# Altium project BRR_CB_P03_REV_A1_1-STM32MP157.PrjPcb (part 3 of 3)

## Sheet HB_Logic_Power_Controller.SchDoc
size A4; SheetNumber: 14; SheetTotal: 14
Used 4 times, as channels U_HB_Logic_Power_Controller, U_HB_Logic_Power_Controller, U_HB_Logic_Power_Controller, U_HB_Logic_Power_Controller. Parts and nets are listed once, with the designators drawn on the sheet.
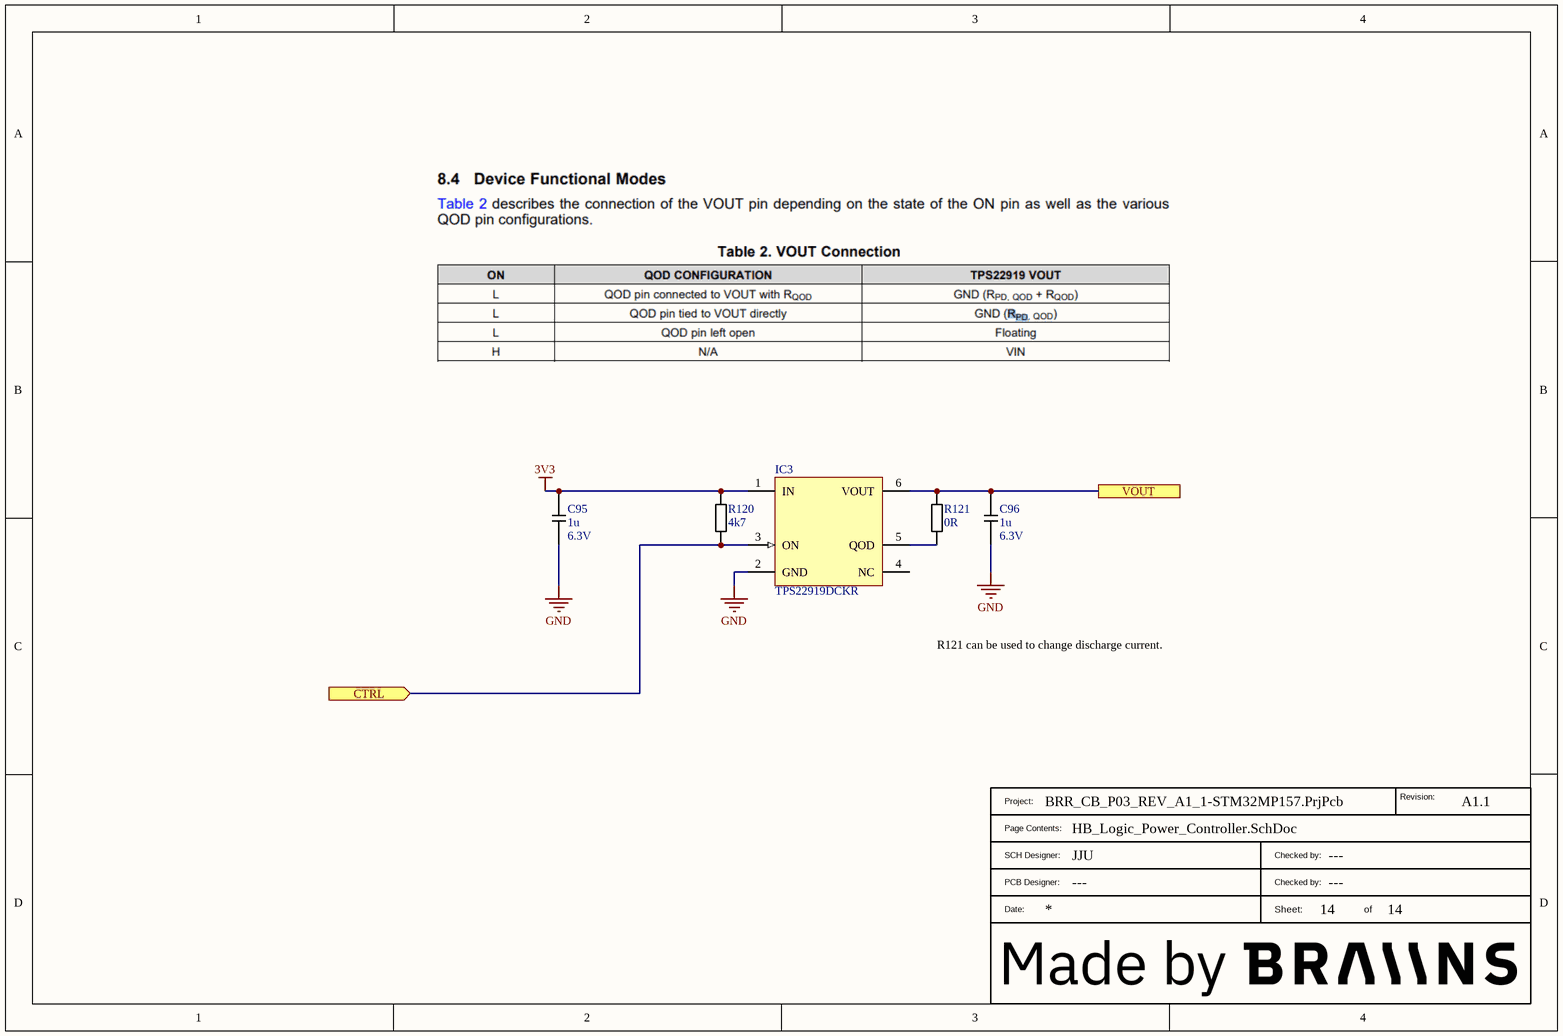
[diagram p13: HB_Logic_Power_Controller.SchDoc]

### Parts
?  BraiinsTitleBlockWithLogo  (value not drawn)  (graphical)
C95  Voltage_Rating: 6.3V  [CAP0402]  (hidden comment: 1u)
C96  Voltage_Rating: 6.3V  [CAP0402]  (hidden comment: 1u)
IC3  TPS22919DCKR  [SC-70]
R120  4k7  [RES0402]
R121  0R  [RES0603]

### Ports
CTRL (in), VOUT

### Nets
3V3: C95.1 IC3.1(IN) R120.2
GND: C95.2 C96.2 IC3.2(GND)
CTRL: IC3.3(ON) R120.1 ; port CTRL
VOUT: C96.1 IC3.6(VOUT) R121.1 ; port VOUT
NetIC3_5: IC3.5(QOD) R121.2

Not connected (* = marked no-connect by the designer): IC3 4(NC)

### Channels
U_HB_Logic_Power_Controller: designators ?=?A#2 C95=C95A C96=C96A IC3=IC3A R120=R120A R121=R121A; ports CTRL=HB_PWR_CTL0 VOUT=3V3_PROTECTED
U_HB_Logic_Power_Controller: designators ?=?B#2 C95=C95B C96=C96B IC3=IC3B R120=R120B R121=R121B; ports CTRL=HB_PWR_CTL1 VOUT=3V3_PROTECTED
U_HB_Logic_Power_Controller: designators ?=?C#2 C95=C95C C96=C96C IC3=IC3C R120=R120C R121=R121C; ports CTRL=HB_PWR_CTL2 VOUT=3V3_PROTECTED
U_HB_Logic_Power_Controller: designators ?=?D#2 C95=C95D C96=C96D IC3=IC3D R120=R120D R121=R121D; ports CTRL=HB_PWR_CTL3 VOUT=3V3_PROTECTED

### Notes on the sheet
- R121 can be used to change discharge current.
- (in symbol BraiinsTitleBlockWithLogo) Revision:; Project:; Page Contents:; SCH Designer:; Checked by:; PCB Designer:; Date:; Sheet:; of

### Library data of the parts
C95 C96 = 30155: as C60-C78 on sheet MPU PWR; Value: 1u; Sub_Type: CER; Manufacturer Part Description: CAP CER 1u 10% 6.3V X7R 0402; Package_Case: 0402; RoHS: Yes; Dielectric: X7R; Tolerance: 10%; Created By: janjuranek; Created_Date: 2023-05-01 19:24:23; Updated_Date: 2023-05-01 19:25:09; ComponentLink1Description: Datasheet; ComponentLink2Description: Supplier Part Details
IC3 = 30187: Self-Protected Load Switch, 5.5 V, 1.5 A, 90-mΩ; Part_Type: IC; Part_Status: New; ID: 30187; Updated By: janjuranek; Value: TPS22919DCKR; Manufacturer Part Number: TPS22919DCKR; Manufacturer Part Description: Self-Protected Load Switch, 5.5 V, 1.5 A, 90-mΩ; Package_Case: SC-70; RoHS: Yes; Created By: janjuranek; Created_Date: 2023-05-26 10:45:28; Updated_Date: 2023-05-26 10:46:59; ComponentLink1Description: Datasheet; ComponentLink2Description: Supplier Part Details
R120 = 30073: as R85-R87 on sheet HBInterface; Value: 4k7; Part_Type: Resistor; Manufacturer Part Description: RES 4k7 Ohm 1% 0402; Package_Case: 0402; RoHS: Yes; Temperature Range: -40 to +150C; Tolerance: 1%; Created By: Jan; Created_Date: 2023-03-02 13:15:12; Updated_Date: 2023-03-02 13:15:46; ComponentLink1Description: Datasheet; ComponentLink2Description: Supplier Part Details
R121 = 30097: RES 0R Ohm 1% 0603; Part_Status: New; ID: 30097; Updated By: janjuranek; Sorted_Value: 0; Value: 0R; Part_Type: Resistor; Manufacturer Part Description: RES 0R Ohm 1% 0603; Package_Case: 0603; RoHS: Yes; Tolerance: 1%; Created By: janjuranek; Created_Date: 2023-03-07 17:09:44; Updated_Date: 2023-03-07 22:04:59; ComponentLink1Description: Datasheet; ComponentLink2Description: Supplier Part Details

## Nets that join several sheets
1V35: MPU (45 pins), PowerSupply (5 pins), RAM (30 pins), MPU PWR (21 pins)
3V3: MPU (21 pins), Ethernet (13 pins), Fan (R29.1 R30.1 R33.1 R34.1), PowerSupply (5 pins), SDCard (11 pins), EMMC (17 pins), RAM (C93.1 C94.1 IC2.6), Debug (CON11.8 R23.1 R24.1), UserInterface (R90.2), PowerSupplyInterface (R94.1 R95.1), MPU PWR (C81.1 C82.1 C83.1 C84.1), U_HB_Logic_Power_Controller (C95A.1 IC3A.1 R120A.2), U_HB_Logic_Power_Controller (C95B.1 IC3B.1 R120B.2), U_HB_Logic_Power_Controller (C95C.1 IC3C.1 R120C.2), U_HB_Logic_Power_Controller (C95D.1 IC3D.1 R120D.2)
12V: Fan (CON1.3 CON2.3 CON3.3 CON4.3), PowerSupply (CON6.1 CON6.3 CON6.5 D5.2)
DDR_VREF: MPU (U1.W16), RAM (48 pins)
GND: MPU (106 pins), Ethernet (20 pins), Fan (8 pins), PowerSupply (24 pins), SDCard (5 pins), EMMC (17 pins), RAM (62 pins), U_HBInterface_0 (10 pins), U_HBInterface_1 (9 pins), U_HBInterface_2 (9 pins), U_HBInterface_3 (8 pins), Debug (CON10.1 CON11.1 S1.1), UserInterface (C50.2 D9.2 D9.4 S2.1), PowerSupplyInterface (CON8.3), MPU PWR (25 pins), U_HB_Logic_Power_Controller (C95A.2 C96A.2 IC3A.2), U_HB_Logic_Power_Controller (C95B.2 C96B.2 IC3B.2), U_HB_Logic_Power_Controller (C95C.2 C96C.2 IC3C.2), U_HB_Logic_Power_Controller (C95D.2 C96D.2 IC3D.2)
3V3_PROTECTED: U_HBInterface_0 (CON7A.16 R85A.1 R86A.1), U_HB_Logic_Power_Controller (C96A.1 IC3A.6 R121A.1)
3V3_PROTECTED: U_HBInterface_1 (CON7B.8 CON7B.16 R85B.1 R86B.1), U_HB_Logic_Power_Controller (C96B.1 IC3B.6 R121B.1)
3V3_PROTECTED: U_HBInterface_2 (CON7C.7 CON7C.16 R85C.1 R86C.1), U_HB_Logic_Power_Controller (C96C.1 IC3C.6 R121C.1)
3V3_PROTECTED: U_HBInterface_3 (5 pins), U_HB_Logic_Power_Controller (C96D.1 IC3D.6 R121D.1)
BOOT0: MPU (U1.K1), SDCard (R117.2)
BOOT1: MPU (U1.K4), SDCard (R118.2)
BOOT2: MPU (U1.L2), SDCard (R106.2)
CARD_DETECT: MPU (U1.K3), SDCard (R119.2)
DDR3_A0: MPU (U1.H18), RAM (IC6.N3 R57.1)
DDR3_A1: MPU (U1.M17), RAM (IC6.P7 R58.1)
DDR3_A2: MPU (U1.G18), RAM (IC6.P3 R59.1)
DDR3_A3: MPU (U1.F19), RAM (IC6.N2 R60.1)
DDR3_A4: MPU (U1.P17), RAM (IC6.P8 R61.1)
DDR3_A5: MPU (U1.H17), RAM (IC6.P2 R62.1)
DDR3_A6: MPU (U1.N16), RAM (IC6.R8 R65.1)
DDR3_A7: MPU (U1.E17), RAM (IC6.R2 R66.1)
DDR3_A8: MPU (U1.R17), RAM (IC6.T8 R67.1)
DDR3_A9: MPU (U1.G17), RAM (IC6.R3 R69.1)
DDR3_A10: MPU (U1.M19), RAM (IC6.L7 R70.1)
DDR3_A11: MPU (U1.M18), RAM (IC6.R7 R71.1)
DDR3_A12: MPU (U1.L17), RAM (IC6.N7 R73.1)
DDR3_A13: MPU (U1.F17), RAM (IC6.T3 R74.1)
DDR3_BA0: MPU (U1.G19), RAM (IC6.M2 R76.1)
DDR3_BA1: MPU (U1.N17), RAM (IC6.N8 R77.1)
DDR3_BA2: MPU (U1.J16), RAM (IC6.M3 R78.1)
DDR3_CASN: MPU (U1.K17), RAM (IC6.K3 R80.1)
DDR3_CKE: MPU (U1.P19), RAM (IC6.K9 R68.1 R82.1)
DDR3_CLK_N: MPU (U1.K19), RAM (IC6.K7 R63.2)
DDR3_CLK_P: MPU (U1.L19), RAM (IC6.J7 R63.1)
DDR3_CSN: MPU (U1.J18), RAM (IC6.L2 R81.1)
DDR3_DQ0: MPU (U1.A17), RAM (IC6.E3)
DDR3_DQ1: MPU (U1.A18), RAM (IC6.F7)
DDR3_DQ2: MPU (U1.D18), RAM (IC6.F2)
DDR3_DQ3: MPU (U1.B17), RAM (IC6.F8)
DDR3_DQ4: MPU (U1.E18), RAM (IC6.H3)
DDR3_DQ5: MPU (U1.D17), RAM (IC6.H8)
DDR3_DQ6: MPU (U1.D19), RAM (IC6.G2)
DDR3_DQ7: MPU (U1.B18), RAM (IC6.H7)
DDR3_DQ8: MPU (U1.P18), RAM (IC6.D7)
DDR3_DQ9: MPU (U1.T17), RAM (IC6.C3)
DDR3_DQ10: MPU (U1.R18), RAM (IC6.C8)
DDR3_DQ11: MPU (U1.V19), RAM (IC6.C2)
DDR3_DQ12: MPU (U1.W18), RAM (IC6.A7)
DDR3_DQ13: MPU (U1.T18), RAM (IC6.A2)
DDR3_DQ14: MPU (U1.V18), RAM (IC6.B8)
DDR3_DQ15: MPU (U1.W17), RAM (IC6.A3)
DDR3_DQM0: MPU (U1.C18), RAM (IC6.E7)
DDR3_DQM1: MPU (U1.U18), RAM (IC6.D3)
DDR3_DQS0_N: MPU (U1.C19), RAM (IC6.F3)
DDR3_DQS0_P: MPU (U1.B19), RAM (IC6.G3)
DDR3_DQS1_N: MPU (U1.T19), RAM (IC6.B7)
DDR3_DQS1_P: MPU (U1.U19), RAM (IC6.C7)
DDR3_ODT: MPU (U1.H19), RAM (IC6.K1 R84.1)
DDR3_RASN: MPU (U1.L18), RAM (IC6.J3 R79.1)
DDR3_RESETN: MPU (U1.G16), RAM (IC6.T2 R72.1)
DDR3_WEN: MPU (U1.J17), RAM (IC6.L3 R83.1)
EMMC_RESET: MPU (U1.A9), EMMC (IC5.K5 R53.2)
ETH_CLK: MPU (R75.2 R116.2), Ethernet (R15.1)
ETH_CRS_DV: MPU (U1.T6), Ethernet (R13.1)
ETH_MDC: MPU (U1.V2), Ethernet (R99.1)
ETH_MDIO: MPU (U1.W2), Ethernet (IC1.16 R8.2)
ETH_PHY_RESET: MPU (U1.T7), Ethernet (IC1.19 R103.1)
ETH_RXD0: MPU (U1.W4), Ethernet (R11.1)
ETH_RXD1: MPU (U1.V4), Ethernet (R10.1)
ETH_TX_EN: MPU (U1.V1), Ethernet (R100.1)
ETH_TXD0: MPU (U1.U2), Ethernet (R101.1)
ETH_TXD1: MPU (U1.T9), Ethernet (R102.1)
HB0_PLUG: MPU (U1.D6), U_HBInterface_0 (CON7A.5 R87A.1)
HB0_RESET: MPU (U1.C5), U_HBInterface_0 (CON7A.15)
HB1_PLUG: MPU (U1.V7), U_HBInterface_1 (CON7B.5 R87B.1)
HB1_RESET: MPU (U1.W9), U_HBInterface_1 (CON7B.15)
HB2_PLUG: MPU (U1.V10), U_HBInterface_2 (CON7C.5 R87C.1)
HB2_RESET: MPU (U1.U10), U_HBInterface_2 (CON7C.15)
HB3_PLUG: MPU (U1.C2), U_HBInterface_3 (CON7D.5 R87D.1)
HB3_RESET: MPU (U1.C1), U_HBInterface_3 (CON7D.15)
HB_PWR_CTL0: MPU (U1.G1), U_HB_Logic_Power_Controller (IC3A.3 R120A.1)
HB_PWR_CTL1: MPU (U1.F1), U_HB_Logic_Power_Controller (IC3B.3 R120B.1)
HB_PWR_CTL2: MPU (U1.E1), U_HB_Logic_Power_Controller (IC3C.3 R120C.1)
HB_PWR_CTL3: MPU (U1.U1), U_HB_Logic_Power_Controller (IC3D.3 R120D.1)
HB_RXD: MPU (U1.T8), U_HBInterface_1 (CON7B.12 R85B.2)
HB_RXD: MPU (U1.G3), U_HBInterface_0 (CON7A.12 R85A.2)
HB_RXD: MPU (U1.C4), U_HBInterface_3 (CON7D.12 R85D.2)
HB_RXD: MPU (U1.T10), U_HBInterface_2 (CON7C.12 R85C.2)
HB_TXD: MPU (U1.T12), U_HBInterface_1 (CON7B.11 R86B.2)
HB_TXD: MPU (U1.F2), U_HBInterface_0 (CON7A.11 R86A.2)
HB_TXD: MPU (U1.B1), U_HBInterface_3 (CON7D.11 R86D.2)
HB_TXD: MPU (U1.T11), U_HBInterface_2 (CON7C.11 R86C.2)
I2C1_SCL: MPU (R110.2 U1.U11), U_HBInterface_0 (CON7A.4), U_HBInterface_1 (CON7B.4), U_HBInterface_2 (CON7C.4), U_HBInterface_3 (CON7D.4)
I2C1_SDA: MPU (R109.2 U1.U12), U_HBInterface_0 (CON7A.3), U_HBInterface_1 (CON7B.3), U_HBInterface_2 (CON7C.3), U_HBInterface_3 (CON7D.3)
I2C2_SCL: MPU (R108.2 U1.B4), PowerSupplyInterface (CON8.6 R95.2)
I2C2_SDA: MPU (R107.2 U1.A2), PowerSupplyInterface (CON8.5 R94.2)
LED_G: MPU (U1.T16), UserInterface (R89.1)
LED_R: MPU (U1.W8), UserInterface (R88.1)
NetC89_2: MPU (C89.2 C90.1 U1.J1), Debug (CON11.2 R23.2 S1.2)
NetCON11_3: MPU (U1.D14), Debug (CON11.3)
NetCON11_4: MPU (U1.D16), Debug (CON11.4)
NetCON11_5: MPU (U1.D15), Debug (CON11.5)
NetCON11_6: MPU (U1.D13), Debug (CON11.6)
NetCON11_7: MPU (U1.D12), Debug (CON11.7 R24.2)
PWM_A: MPU (U1.D3), Fan (R25.1 R27.1)
PWM_B: MPU (U1.W5), Fan (R26.1 R28.1)
PWR_CONTROL: MPU (U1.D7), PowerSupplyInterface (CON8.4)
RPM_A0: MPU (U1.P4), Fan (R29.2 R31.1)
RPM_A1: MPU (U1.R3), Fan (R33.2 R35.1)
RPM_B0: MPU (U1.P3), Fan (R30.2 R32.1)
RPM_B1: MPU (U1.T5), Fan (R34.2 R36.1)
SDMMC1_CK: MPU (U1.C10), SDCard (R47.1)
SDMMC1_CMD: MPU (U1.B10), SDCard (R48.1)
SDMMC1_D0: MPU (U1.C11), SDCard (R43.1)
SDMMC1_D1: MPU (U1.A10), SDCard (R44.1)
SDMMC1_D2: MPU (U1.D11), SDCard (R45.1)
SDMMC1_D3: MPU (U1.A11), SDCard (R46.1)
SDMMC2_CK: MPU (U1.A5), EMMC (R104.1)
SDMMC2_CMD: MPU (U1.A6), EMMC (IC5.M5 R55.2)
SDMMC2_D0: MPU (U1.C9), EMMC (IC5.A3 R56.2)
SDMMC2_D1: MPU (U1.A8), EMMC (IC5.A4)
SDMMC2_D2: MPU (U1.A7), EMMC (IC5.A5)
SDMMC2_D3: MPU (U1.B9), EMMC (IC5.B2)
SDMMC2_D4: MPU (U1.B8), EMMC (IC5.B3)
SDMMC2_D5: MPU (U1.C8), EMMC (IC5.B4)
SDMMC2_D6: MPU (U1.B7), EMMC (IC5.B5)
SDMMC2_D7: MPU (U1.C6), EMMC (IC5.B6)
UART4_RX: MPU (U1.V17), Debug (CON10.3)
UART4_TX: MPU (U1.U16), Debug (CON10.2)
USER_BUTTON: MPU (U1.W10), UserInterface (C50.1 R91.2)

## Assembly variants
Production: not fitted CON11 R116